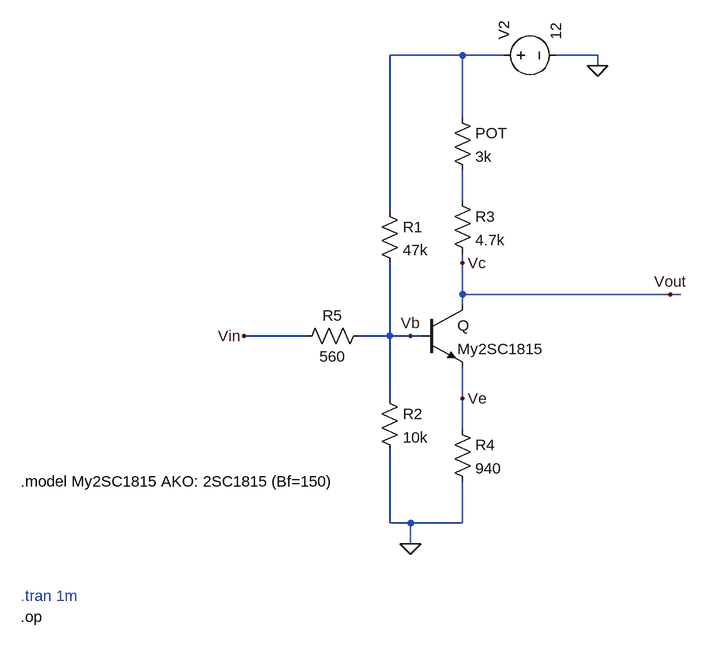
[diagram p0: schematic H2DC.asc]
H2DC.asc, the LTspice schematic file:
Version 4.1
SHEET 1 880 696
WIRE 144 -240 32 -240
WIRE 208 -240 144 -240
WIRE 352 -240 288 -240
WIRE 352 -224 352 -240
WIRE 144 -144 144 -240
WIRE 144 -16 144 -64
WIRE 32 0 32 -240
WIRE 144 80 144 64
WIRE 144 128 144 80
WIRE 464 128 144 128
WIRE 480 128 464 128
WIRE 144 144 144 128
WIRE -96 192 -192 192
WIRE 32 192 32 80
WIRE 32 192 -16 192
WIRE 64 192 32 192
WIRE 80 192 64 192
WIRE 32 288 32 192
WIRE 144 288 144 240
WIRE 144 336 144 288
WIRE 32 480 32 368
WIRE 64 480 32 480
WIRE 144 480 144 416
WIRE 144 480 64 480
WIRE 64 512 64 480
FLAG 64 512 0
FLAG 352 -224 0
FLAG 64 192 Vb
FLAG 144 80 Vc
FLAG 464 128 Vout
FLAG -192 192 Vin
FLAG 144 288 Ve
SYMBOL npn 80 144 R0
SYMATTR InstName Q
SYMATTR Value My2SC1815
SYMBOL res 16 -16 R0
SYMATTR InstName R1
SYMATTR Value 47k
SYMBOL res 128 -32 R0
SYMATTR InstName R3
SYMATTR Value 4.7k
SYMBOL voltage 192 -240 R270
WINDOW 123 0 0 Left 0
WINDOW 39 0 0 Left 0
SYMATTR InstName V2
SYMATTR Value 12
SYMBOL res 128 320 R0
SYMATTR InstName R4
SYMATTR Value 940
SYMBOL res 16 272 R0
SYMATTR InstName R2
SYMATTR Value 10k
SYMBOL res 128 -160 R0
SYMATTR InstName POT
SYMATTR Value 3k
SYMBOL res 0 176 R90
WINDOW 0 0 56 VBottom 2
WINDOW 3 32 56 VTop 2
SYMATTR InstName R5
SYMATTR Value 560
TEXT -536 416 Left 2 !.model My2SC1815 AKO: 2SC1815 (Bf=150)
TEXT -536 592 Left 2 ;.tran 1m
TEXT -536 624 Left 2 !.op

The netlist it stands for:
* H2DC.asc
Q Vout Vb Ve 0 My2SC1815
R1 N001 Vb 47k
R3 N002 Vout 4.7k
V2 N001 0 12
R4 Ve 0 940
R2 Vb 0 10k
R§POT N001 N002 3k
R5 Vb Vin 560
.model NPN NPN
.model PNP PNP
.lib standard.bjt
.model My2SC1815 AKO: 2SC1815 (Bf=150)
* .tran 1m
.op
.backanno
.end